# Altium schematic sheet USBC_DS3_DS4.SchDoc
size A3; SheetNumber: 1; SheetTotal: 4
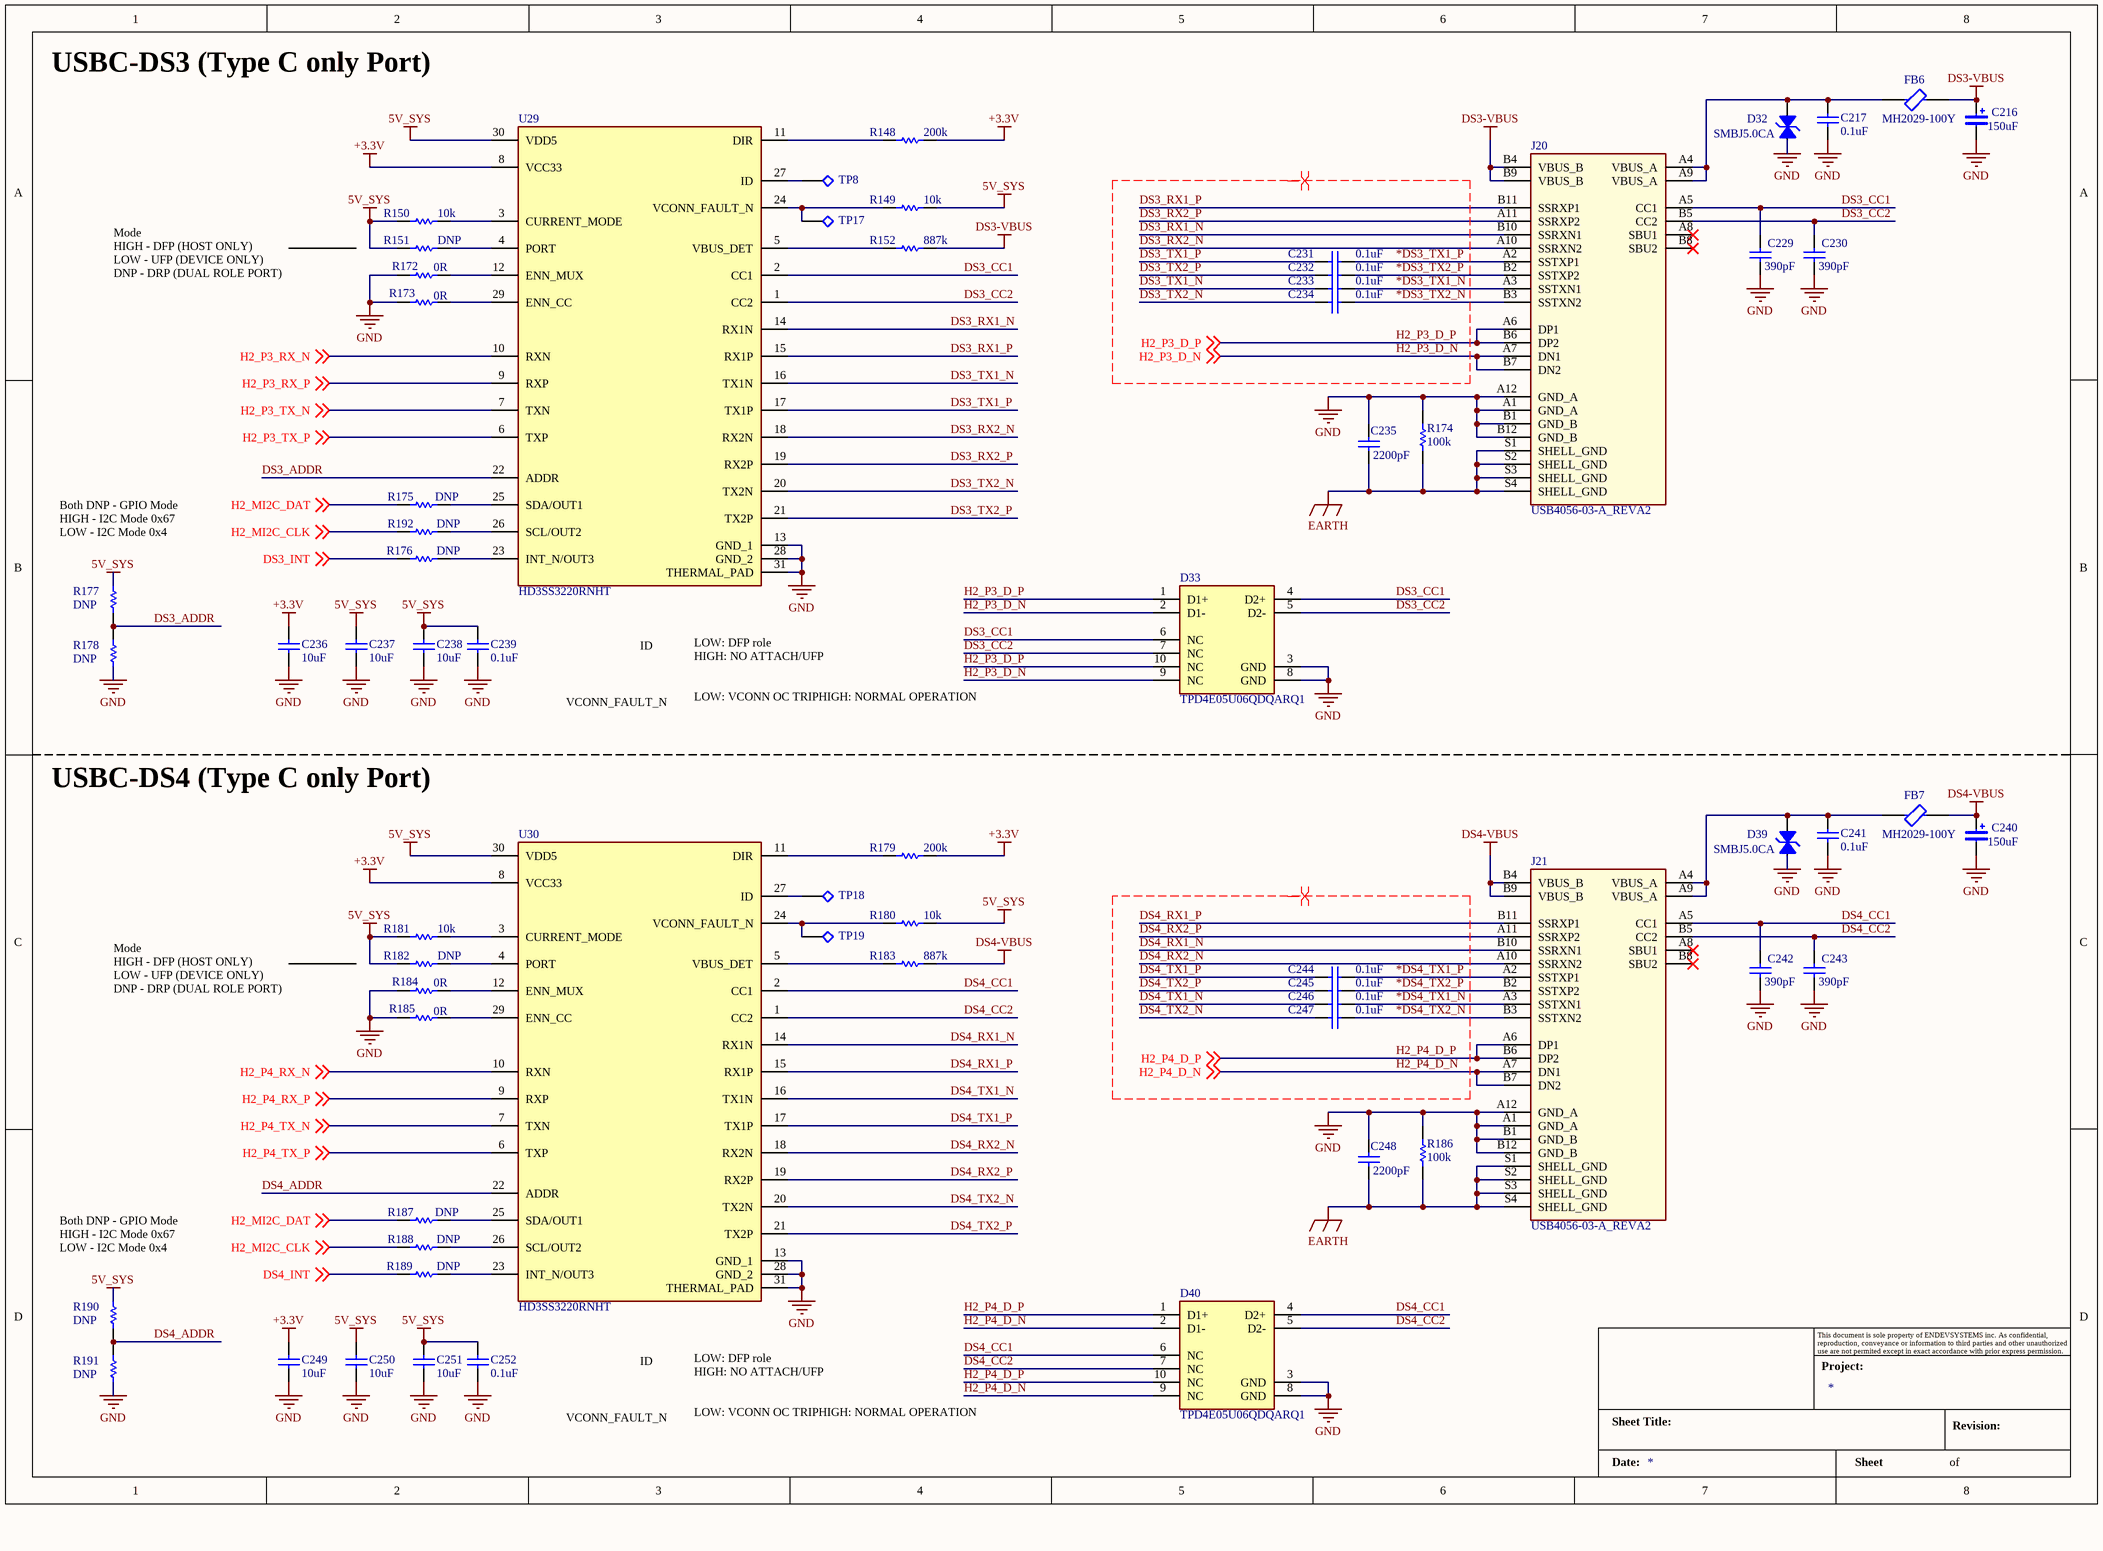
[diagram p0: USBC_DS3_DS4.SchDoc]

## Parts
?  Title_Block  (value not drawn)  (graphical)
C216  150uF  [CAP-TAN-2312]
C217  0.1uF  [CAP 1206/3216]
C229  390pF  [C-0805/2012]
C230  390pF  [C-0805/2012]
C231  0.1uF  [CAP 1206/3216]
C232  0.1uF  [CAP 1206/3216]
C233  0.1uF  [CAP 1206/3216]
C234  0.1uF  [CAP 1206/3216]
C235  2200pF  [C-0603/1608]
C236  10uF  [CAP 1206/3216]
C237  10uF  [CAP 1206/3216]
C238  10uF  [CAP 1206/3216]
C239  0.1uF  [CAP 1206/3216]
C240  150uF  [CAP-TAN-2312]
C241  0.1uF  [CAP 1206/3216]
C242  390pF  [C-0805/2012]
C243  390pF  [C-0805/2012]
C244  0.1uF  [CAP 1206/3216]
C245  0.1uF  [CAP 1206/3216]
C246  0.1uF  [CAP 1206/3216]
C247  0.1uF  [CAP 1206/3216]
C248  2200pF  [C-0603/1608]
C249  10uF  [CAP 1206/3216]
C250  10uF  [CAP 1206/3216]
C251  10uF  [CAP 1206/3216]
C252  0.1uF  [CAP 1206/3216]
D32  SMBJ5.0CA  [DO-214AA\SMB]
D33  TPD4E05U06QDQARQ1  [FP-DQA0010A-MFG]
D39  SMBJ5.0CA  [DO-214AA\SMB]
D40  TPD4E05U06QDQARQ1  [FP-DQA0010A-MFG]
FB6  MH2029-100Y  [R-0805/2012]
FB7  MH2029-100Y  [R-0805/2012]
J20  USB4056-03-A_REVA2  [GCT_USB4056-03-A_REVA2]
J21  USB4056-03-A_REVA2  [GCT_USB4056-03-A_REVA2]
R148  200k  [R-0402]
R149  10k  [R-0402]
R150  10k  [R-0402]
R151  DNP  [R-0402]
R152  887k  [R-0402]
R172  0R  [R-0402]
R173  0R  [R-0402]
R174  100k  [R-0603/1608]
R175  DNP  [R-0402]
R176  DNP  [R-0402]
R177  DNP  [R-0402]
R178  DNP  [R-0402]
R179  200k  [R-0402]
R180  10k  [R-0402]
R181  10k  [R-0402]
R182  DNP  [R-0402]
R183  887k  [R-0402]
R184  0R  [R-0402]
R185  0R  [R-0402]
R186  100k  [R-0603/1608]
R187  DNP  [R-0402]
R188  DNP  [R-0402]
R189  DNP  [R-0402]
R190  DNP  [R-0402]
R191  DNP  [R-0402]
R192  DNP  [R-0402]
TP8  Test Points  [Test Point TH Round H0.9,D1.6]  (value not drawn)
TP17  Test Points  [Test Point TH Round H0.9,D1.6]  (value not drawn)
TP18  Test Points  [Test Point TH Round H0.9,D1.6]  (value not drawn)
TP19  Test Points  [Test Point TH Round H0.9,D1.6]  (value not drawn)
U29  HD3SS3220RNHT  [QFN40P250X450X80-31N-D]
U30  HD3SS3220RNHT  [QFN40P250X450X80-31N-D]

## Nets
5V_SYS: C237.2 C238.2 C239.2 C250.2 C251.2 C252.2 R149.2 R150.1 R151.1 R177.2 R180.2 R181.1 R182.1 R190.2 U29.30(VDD5) U30.30(VDD5)
+3.3V: C236.2 C249.2 R148.2 R179.2 U29.8(VCC33) U30.8(VCC33)
DS3-VBUS: C216.+ FB6.2 J20.B4(VBUS_B) J20.B9(VBUS_B) R152.1
DS4-VBUS: C240.+ FB7.2 J21.B4(VBUS_B) J21.B9(VBUS_B) R183.1
EARTH: C235.1 C248.1 J20.S1(SHELL_GND) J20.S2(SHELL_GND) J20.S3(SHELL_GND) J20.S4(SHELL_GND) J21.S1(SHELL_GND) J21.S2(SHELL_GND) J21.S3(SHELL_GND) J21.S4(SHELL_GND) R174.1 R186.1
GND: C216.- C217.2 C229.1 C230.1 C235.2 C236.2 C237.2 C238.2 C239.2 C240.- C241.2 C242.1 C243.1 C248.2 C249.2 C250.2 C251.2 C252.2 D32.1 D33.3(GND) D33.8(GND) D39.1 D40.3(GND) D40.8(GND) J20.A1(GND_A) J20.A12(GND_A) J20.B1(GND_B) J20.B12(GND_B) J21.A1(GND_A) J21.A12(GND_A) J21.B1(GND_B) J21.B12(GND_B) R172.1 R173.1 R174.2 R178.1 R184.1 R185.1 R186.2 R191.1 U29.13(GND_1) U29.28(GND_2) U29.31(THERMAL_PAD) U30.13(GND_1) U30.28(GND_2) U30.31(THERMAL_PAD)
*DS3_TX1_N: C233.2 J20.A3(SSTXN1)
*DS3_TX1_P: C231.2 J20.A2(SSTXP1)
*DS3_TX2_N: C234.2 J20.B3(SSTXN2)
*DS3_TX2_P: C232.2 J20.B2(SSTXP2)
*DS4_TX1_N: C246.2 J21.A3(SSTXN1)
*DS4_TX1_P: C244.2 J21.A2(SSTXP1)
*DS4_TX2_N: C247.2 J21.B3(SSTXN2)
*DS4_TX2_P: C245.2 J21.B2(SSTXP2)
DS3_ADDR: R177.1 R178.2 U29.22(ADDR)
DS3_CC1: C229.2 D33.4(D2+) D33.6(NC) J20.A5(CC1) U29.2(CC1)
DS3_CC2: C230.2 D33.5(D2-) D33.7(NC) J20.B5(CC2) U29.1(CC2)
DS3_INT: R176.1 ; off-sheet DS3_INT
DS3_RX1_N: J20.B10(SSRXN1) U29.14(RX1N)
DS3_RX1_P: J20.B11(SSRXP1) U29.15(RX1P)
DS3_RX2_N: J20.A10(SSRXN2) U29.18(RX2N)
DS3_RX2_P: J20.A11(SSRXP2) U29.19(RX2P)
DS3_TX1_N: C233.2 U29.16(TX1N)
DS3_TX1_P: C231.2 U29.17(TX1P)
DS3_TX2_N: C234.2 U29.20(TX2N)
DS3_TX2_P: C232.2 U29.21(TX2P)
DS4_ADDR: R190.1 R191.2 U30.22(ADDR)
DS4_CC1: C242.2 D40.4(D2+) D40.6(NC) J21.A5(CC1) U30.2(CC1)
DS4_CC2: C243.2 D40.5(D2-) D40.7(NC) J21.B5(CC2) U30.1(CC2)
DS4_INT: R189.1 ; off-sheet DS4_INT
DS4_RX1_N: J21.B10(SSRXN1) U30.14(RX1N)
DS4_RX1_P: J21.B11(SSRXP1) U30.15(RX1P)
DS4_RX2_N: J21.A10(SSRXN2) U30.18(RX2N)
DS4_RX2_P: J21.A11(SSRXP2) U30.19(RX2P)
DS4_TX1_N: C246.2 U30.16(TX1N)
DS4_TX1_P: C244.2 U30.17(TX1P)
DS4_TX2_N: C247.2 U30.20(TX2N)
DS4_TX2_P: C245.2 U30.21(TX2P)
H2_MI2C_CLK: R188.1 R192.1 ; off-sheet H2_MI2C_CLK
H2_MI2C_DAT: R175.1 R187.1 ; off-sheet H2_MI2C_DAT
H2_P3_D_N: D33.2(D1-) D33.9(NC) J20.A7(DN1) J20.B7(DN2) ; off-sheet H2_P3_D_N
H2_P3_D_P: D33.1(D1+) D33.10(NC) J20.A6(DP1) J20.B6(DP2) ; off-sheet H2_P3_D_P
H2_P3_RX_N: U29.10(RXN) ; off-sheet H2_P3_RX_N
H2_P3_RX_P: U29.9(RXP) ; off-sheet H2_P3_RX_P
H2_P3_TX_N: U29.7(TXN) ; off-sheet H2_P3_TX_N
H2_P3_TX_P: U29.6(TXP) ; off-sheet H2_P3_TX_P
H2_P4_D_N: D40.2(D1-) D40.9(NC) J21.A7(DN1) J21.B7(DN2) ; off-sheet H2_P4_D_N
H2_P4_D_P: D40.1(D1+) D40.10(NC) J21.A6(DP1) J21.B6(DP2) ; off-sheet H2_P4_D_P
H2_P4_RX_N: U30.10(RXN) ; off-sheet H2_P4_RX_N
H2_P4_RX_P: U30.9(RXP) ; off-sheet H2_P4_RX_P
H2_P4_TX_N: U30.7(TXN) ; off-sheet H2_P4_TX_N
H2_P4_TX_P: U30.6(TXP) ; off-sheet H2_P4_TX_P
NetC217_2: C217.2 D32.2 FB6.1 J20.A4(VBUS_A) J20.A9(VBUS_A)
NetC241_2: C241.2 D39.2 FB7.1 J21.A4(VBUS_A) J21.A9(VBUS_A)
NetR148_1: R148.1 U29.11(DIR)
NetR149_1: R149.1 TP17.1 U29.24(VCONN_FAULT_N)
NetR150_2: R150.2 U29.3(CURRENT_MODE)
NetR151_2: R151.2 U29.4(PORT)
NetR152_2: R152.2 U29.5(VBUS_DET)
NetR172_2: R172.2 U29.12(ENN_MUX)
NetR173_2: R173.2 U29.29(ENN_CC)
NetR175_2: R175.2 U29.25(SDA/OUT1)
NetR176_2: R176.2 U29.23(INT_N/OUT3)
NetR179_1: R179.1 U30.11(DIR)
NetR180_1: R180.1 TP19.1 U30.24(VCONN_FAULT_N)
NetR181_2: R181.2 U30.3(CURRENT_MODE)
NetR182_2: R182.2 U30.4(PORT)
NetR183_2: R183.2 U30.5(VBUS_DET)
NetR184_2: R184.2 U30.12(ENN_MUX)
NetR185_2: R185.2 U30.29(ENN_CC)
NetR187_2: R187.2 U30.25(SDA/OUT1)
NetR188_2: R188.2 U30.26(SCL/OUT2)
NetR189_2: R189.2 U30.23(INT_N/OUT3)
NetR192_2: R192.2 U29.26(SCL/OUT2)
NetTP8_1: TP8.1 U29.27(ID)
NetTP18_1: TP18.1 U30.27(ID)

Not connected (* = marked no-connect by the designer): J20 A8(SBU1)* B8(SBU2)*; J21 A8(SBU1)* B8(SBU2)*

## Layout directives
differential pair; differential pair class Diff_90R: *DS3_TX1_N, *DS3_TX1_P, *DS3_TX2_N, *DS3_TX2_P, *DS4_TX1_N, *DS4_TX1_P, *DS4_TX2_N, *DS4_TX2_P, DS3_RX1_N, DS3_RX1_P, DS3_RX2_N, DS3_RX2_P, DS3_TX1_N, DS3_TX1_P, DS3_TX2_N, DS3_TX2_P, DS4_RX1_N, DS4_RX1_P, DS4_RX2_N, DS4_RX2_P, DS4_TX1_N, DS4_TX1_P, DS4_TX2_N, DS4_TX2_P, H2_P3_D_N, H2_P3_D_P, H2_P4_D_N, H2_P4_D_P

## Notes on the sheet
- USBC-DS3 (Type C only Port)
- Mode
  HIGH - DFP (HOST ONLY)
  LOW - UFP (DEVICE ONLY)
  DNP - DRP (DUAL ROLE PORT)
- (near R177) Both DNP - GPIO Mode
  HIGH - I2C Mode 0x67
  LOW - I2C Mode 0x4
- ID
- VCONN_FAULT_N
- LOW: DFP role
  HIGH: NO ATTACH/UFP
- LOW: VCONN OC TRIPHIGH: NORMAL OPERATION
- USBC-DS4 (Type C only Port)
- (near R190) Both DNP - GPIO Mode
  HIGH - I2C Mode 0x67
  LOW - I2C Mode 0x4
- (in symbol Title_Block) This document is sole property of ENDEVSYSTEMS inc. As confidential, reproduction, conveyance or information to third parties and other unauthorized use are not permited except in exact accordance with prior express permission.; Project:; Sheet Title:; Revision:; Date:; Sheet; of

## Library data of the parts
C216 C240 = Capacitor-Polar: CAP TANT 10UF 10% 16V 1206; Mfr. Part No.: F931C106KAAAJ6; Unit Price (USD): 0.67; Value: 10uF 16V; Supplier Part No.: 478-10723-1-ND; Supplier: Digikey Electronics
C217 C231-C234 C236-C239 C241 C244-C247 C249-C252 = CAP 1206/3216: CAP CER 10UF 25V X5R 1206; Mfr. Part No.: C1206C106M3PACTU; Unit Price (USD): 0.28; Supplier Part No.: 399-8153-1-ND; Supplier: Digikey Electronics
C229 C230 C235 C242 C243 C248 = Cap: Capacitor; Value: 0.1uF; Published: 8-Jun-2000; LatestRevisionDate: 17-Jul-2002; LatestRevisionNote: Re-released for DXP Platform.; PackageReference: RAD-0.3; Publisher: Altium Limited; PackageDescription: Radial Cap, Thru-Hole; 2 Leads; 0.3 in Pin Spacing
D32 D39 = ACPDQC3V3T-HF: TVS DIODE 3.3V 9.8V 0402C; Unit Price (USD): 0.41; Mfr. Part No.: ACPDQC3V3T-HF; Supplier Part No.: 641-1635-1-ND; Supplier: Digikey Electronics
D33 D40 = CMP-04985-000004-1: TVS DIODE 5.5V 14V 10USON; Manufacturer: Texas Instruments; Direction: Unidirectional; Standoff Height: 0mm; Description: 14V Clamp 2.5A (8/20µs) Ipp Tvs Diode Surface Mount 10-USON (2.5x1); Capacitance: 0.5pF; Number Of Channels: 4; Breakdown Voltage: 6.4V; Peak Pulse Power: 2.5W; Automotive Grade: Grade 1; Value: 0.5pF; Interface: USB,Ethernet,LVDS,Other; Peak Pulse Current: 2.5A; Operating Supply Voltage: 5.5V; Reverse Standoff Voltage: 5.5V; Package: DQA0010A; Temperature Range Low: -40°C; Temperature Range High: +125°C; Ambient Temperature Range Low: -40°C; Device Class L1: Circuit Protection; Clamping Voltage: 14V; Manufacturer Part Number: TPD4E05U06QDQARQ1; Device Class L2: ESD and Circuit Protection ICs; Octopart: https://octopart.com/tpd4e05u06qdqarq1-texas+instruments-48523459; Device Class L3: unset; Height: 0.55mm; Automotive: Yes; ComponentLink2Description: Datasheet; RoHS: TRUE; Ambient Temperature Range High: +125°C; Category: IC; Mouser Description: Automotive 4-Channel ESD Protection Solution for SuperSpeed (up to 5 Gbps) Interface 10-USON -40 to 125; Temperature: -40°C to +125°C; ComponentLink2URL: http://www.ti.com/lit/ds/symlink/tpd4e05u06-q1.pdf; Digikey Description: TVS DIODE 5.5V 14V 10USON; Lead Free: Yes
FB6 FB7 = 5f30dd21d616792df468990f7003faa: Chip Ferrite Bead Array, 1206, 50Ω @ 100MHz, 0.0016Ω, ±12.5Ω, 12A; Number of Lines: 1; DC Resistance (DCR): 1.6mR; Max Current Rating: 12A; Case Code (Metric): 3216; Package Quantity: 3000; Height: 0.051inch; RoHS Compliant: Yes; Case/Package: 1206; Mount: Surface Mount; Case Code (Imperial): 1206; Width: 0.063inch; Length: 0.126inch; Max Operating Temperature: 125°C; Ratings: AEC-Q200; Packaging: Tape and Reel; Min Operating Temperature: -55°C
J20 J21 = USB4056-03-A_REVA2: USB-C (USB TYPE-C) USB 3.2 Gen 2 (USB 3.1 Gen 2, Superspeed + (USB 3.1)) Receptacle Connector 24 Position Surface Mount, Right Angle; Through Hole; MF: Global Connector Technology; Package: None; Check_prices: https://www.snapeda.com/parts/USB4056-03-A/Global+Connector+Technology/view-part/?ref=eda; Value: *; Availability: In Stock; SnapEDA_Link: https://www.snapeda.com/parts/USB4056-03-A/Global+Connector+Technology/view-part/?ref=snap; MP: USB4056-03-A; Price: None
R148-R152 R172 R173 R175-R185 R187-R192 = Resistor: RES SMD 51 OHM 0.5% 1/16W 0402; Mfr. Part No.: ERA-2AED510X; Value: 51R; Unit Price (USD): 0.21; Supplier Part No.: P51DECT-ND; Supplier: Digikey Electronics
R174 R186 = Res1: Resistor; Value: 10K; Published: 8-Jun-2000; LatestRevisionDate: 17-Jul-2002; LatestRevisionNote: Re-released for DXP Platform.; PackageReference: AXIAL-0.3; Publisher: Altium Limited; PackageDescription: Axial Device, Thru-Hole; 2 Leads; 0.3 in Pin Spacing
U29 U30 = HD3SS3220RNHT: Integrated Circuit; Manufacturer_Name: Texas Instruments; Datasheet Link: http://www.ti.com/lit/gpn/HD3SS3220; Height: 0.8mm; Manufacturer_Part_Number: HD3SS3220RNHT; Mouser Part Number: 595-HD3SS3220RNHT; Mouser Price/Stock: https://www.mouser.co.uk/ProductDetail/Texas-Instruments/HD3SS3220RNHT?qs=8%2FmU9qzJpL9k3fo1z5Ctsg%3D%3D; Arrow Part Number: HD3SS3220RNHT; Arrow Price/Stock: https://www.arrow.com/en/products/hd3ss3220rnht/texas-instruments?region=nac
? = Title_Block: Date:: *; Project:: *